# Altium schematic sheet Final Design.SchDoc
size A0; Organization: Altium Limited; Address1: L3, 12a Rodborough Rd; Address2: Frenchs Forest; Address3: NSW; Address4: Australia 2086
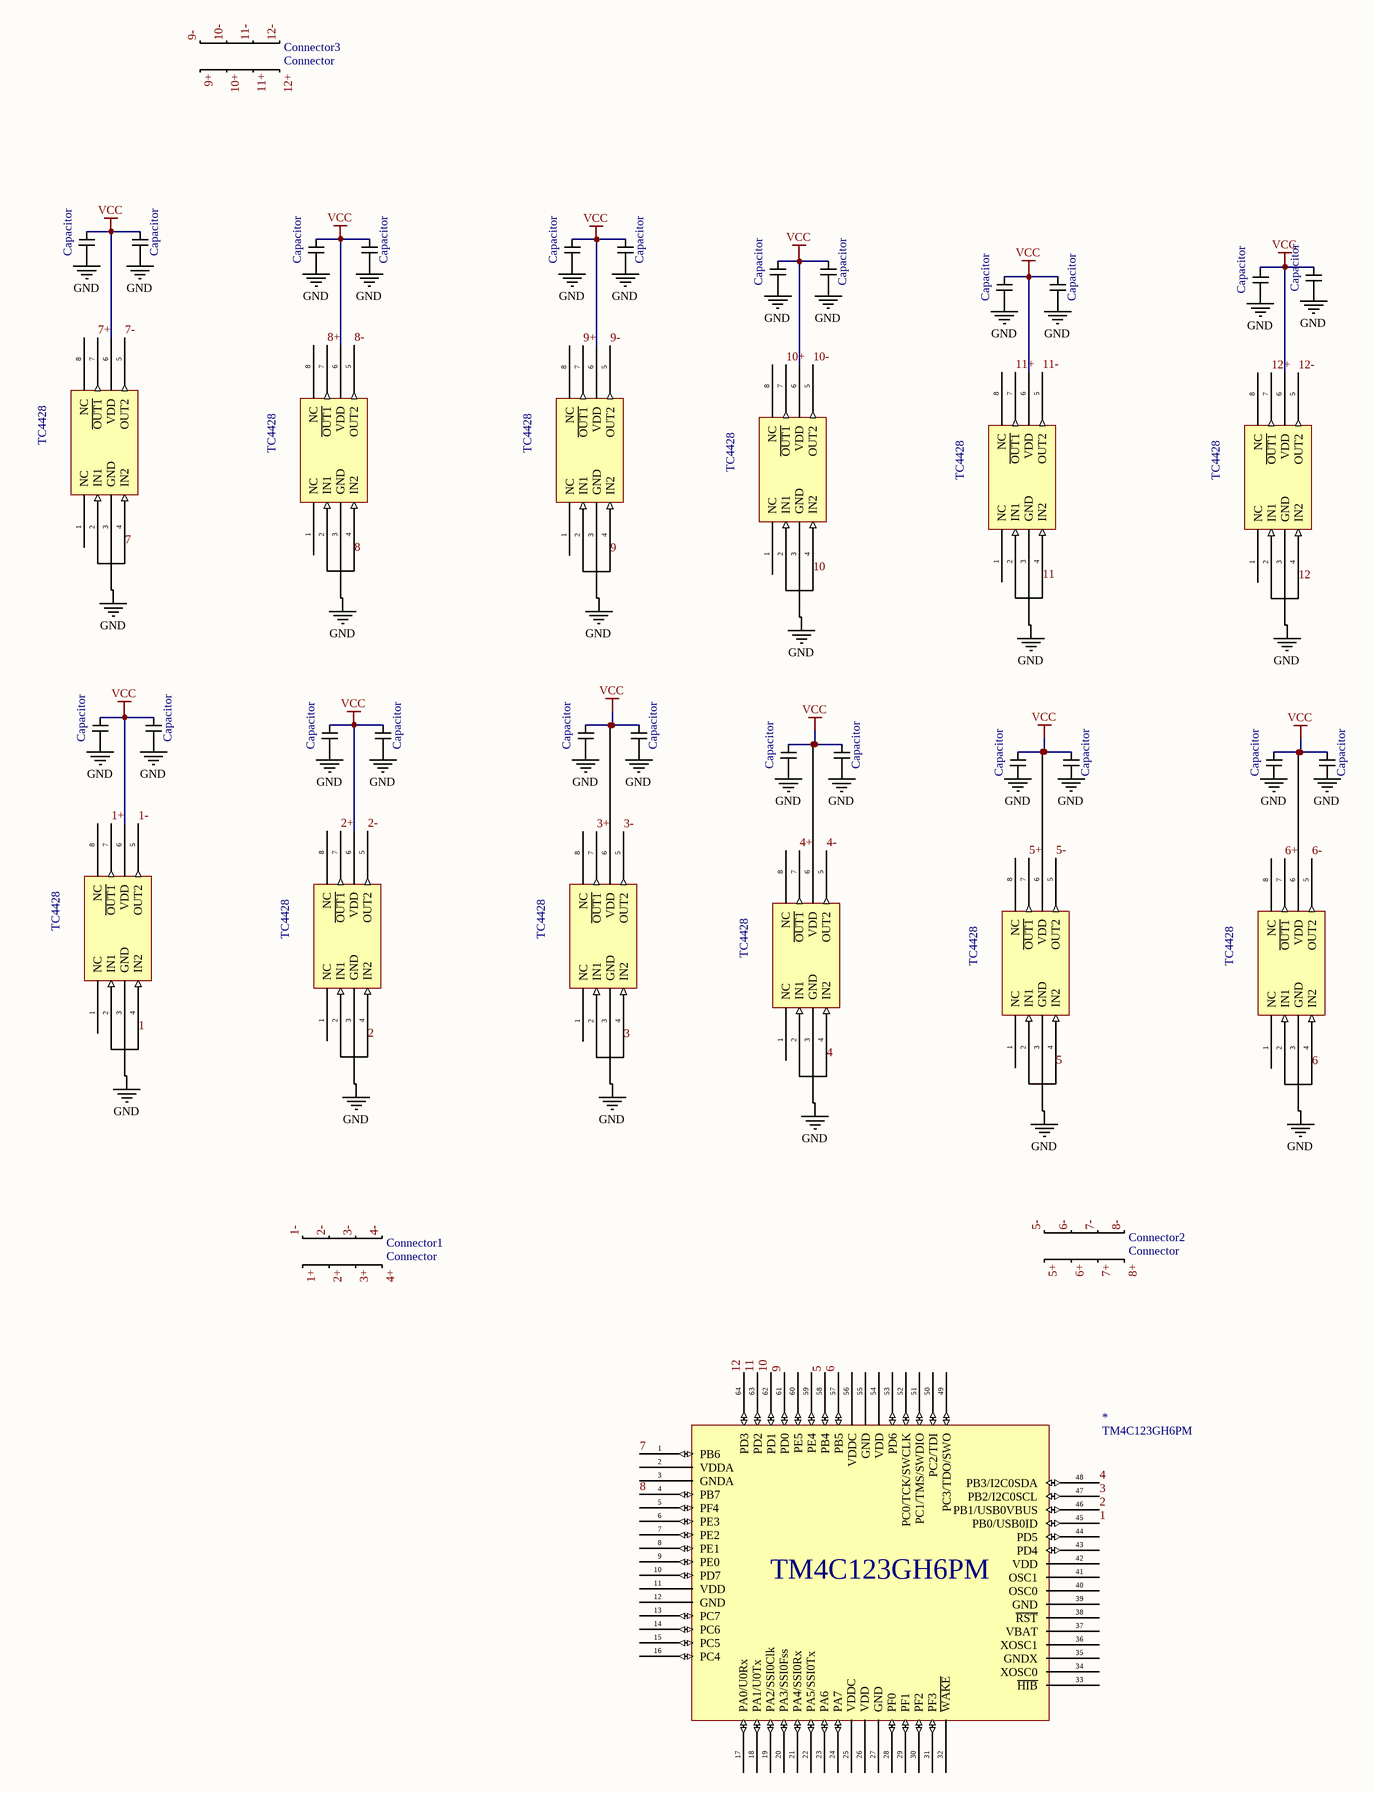
[diagram p0: Final Design.SchDoc]

## Parts
(Parts that share a designator on the sheet are numbered #1, #2 ... from top to bottom, then left to right.)
0.1uF#1  Capacitor  [CAPC3225X06N]
0.1uF#2  Capacitor  [CAPC3225X06N]
0.1uF#3  Capacitor  [CAPC3225X06N]
0.1uF#4  Capacitor  [CAPC3225X06N]
0.1uF#5  Capacitor  [CAPC3225X06N]
0.1uf#6  Capacitor  [CAPC3225X06N]
0.1uF#7  Capacitor  [CAPC3225X06N]
0.1uF#8  Capacitor  [CAPC3225X06N]
0.1uF_3  Capacitor  [CAPC3225X06N]
0.1uF_4  Capacitor  [CAPC3225X06N]
0.1uF_5  Capacitor  [CAPC3225X06N]
0.1uF_6  Capacitor  [CAPC3225X06N]
4.7uF#1  Capacitor  [CAPC3225X06N]
4.7uF#2  Capacitor  [CAPC3225X06N]
4.7uF#3  Capacitor  [CAPC3225X06N]
4.7uF#4  Capacitor  [CAPC3225X06N]
4.7uF#5  Capacitor  [CAPC3225X06N]
4.7uF#6  Capacitor  [CAPC3225X06N]
4.7uF#7  Capacitor  [CAPC3225X06N]
4.7uF_3  Capacitor  [CAPC3225X06N]
4.7uF_4  Capacitor  [CAPC3225X06N]
4.7uF_5  Capacitor  [CAPC3225X06N]
4.7uF_6  Capacitor  [CAPC3225X06N]
4.7uF_11  Capacitor  [CAPC3225X06N]
*  TM4C123GH6PM  [TM4C123]
Connector1  Connector  [Connector]
Connector2  Connector  [Connector]
Connector3  Connector  [Connector]
TC4428_1  TC4428  [TC4428]
TC4428_2  TC4428  [TC4428]
TC4428_3  TC4428  [TC4428]
TC4428_4  TC4428  [TC4428]
TC4428_5  TC4428  [TC4428]
TC4428_6  TC4428  [TC4428]
TC4428_7  TC4428  [TC4428]
TC4428_8  TC4428  [TC4428]
TC4428_9  TC4428  [TC4428]
TC4428_10  TC4428  [TC4428]
TC4428_11  TC4428  [TC4428]
TC4428_12  TC4428  [TC4428]

## Nets
GND: 0.1uF#1.pin-(-) 0.1uF#2.pin-(-) 0.1uF#3.pin-(-) 0.1uF#4.pin-(-) 0.1uf#6.pin-(-) 0.1uF#7.pin-(-) 0.1uF#8.pin-(-) 0.1uF_3.pin-(-) 0.1uF_4.pin-(-) 4.7uF#1.pin-(-) 4.7uF#2.pin-(-) 4.7uF#3.pin-(-) 4.7uF#4.pin-(-) 4.7uF#5.pin-(-) 4.7uF#6.pin-(-) 4.7uF#7.pin-(-) 4.7uF_3.pin-(-) 4.7uF_4.pin-(-) 4.7uF_11.pin-(-) TC4428_1.3(GND) TC4428_2.3(GND) TC4428_3.3(GND) TC4428_4.3(GND) TC4428_5.3(GND) TC4428_6.3(GND) TC4428_7.3(GND) TC4428_8.3(GND) TC4428_9.3(GND) TC4428_10.3(GND) TC4428_11.3(GND) TC4428_12.3(GND)
VCC: 0.1uF#1.pin+(+) 0.1uF#2.pin+(+) 0.1uF#3.pin+(+) 0.1uF#8.pin+(+) 0.1uF_3.pin+(+) 0.1uF_4.pin+(+) 0.1uF_5.pin+(+) 0.1uF_6.pin+(+) 4.7uF#1.pin+(+) 4.7uF#2.pin+(+) 4.7uF#3.pin+(+) 4.7uF#7.pin+(+) 4.7uF_3.pin+(+) 4.7uF_4.pin+(+) 4.7uF_5.pin+(+) 4.7uF_6.pin+(+) TC4428_2.6(VDD) TC4428_3.6(VDD) TC4428_4.6(VDD) TC4428_5.6(VDD) TC4428_6.6(VDD) TC4428_7.6(VDD) TC4428_8.6(VDD) TC4428_9.6(VDD)
1: *.45(PB0/USB0ID) TC4428_1.2(IN1) TC4428_1.4(IN2)
1+: Connector1.1 TC4428_1.7(~{OUT1})
1-: Connector1.5 TC4428_1.5(OUT2)
2: *.46(PB1/USB0VBUS) TC4428_2.2(IN1) TC4428_2.4(IN2)
2+: Connector1.2 TC4428_2.7(~{OUT1})
2-: Connector1.6 TC4428_2.5(OUT2)
3: *.47(PB2/I2C0SCL) TC4428_3.2(IN1) TC4428_3.4(IN2)
3+: Connector1.3 TC4428_3.7(~{OUT1})
3-: Connector1.7 TC4428_3.5(OUT2)
4: *.48(PB3/I2C0SDA) TC4428_4.2(IN1) TC4428_4.4(IN2)
4+: Connector1.4 TC4428_4.7(~{OUT1})
4-: Connector1.8 TC4428_4.5(OUT2)
5: *.58(PB4) TC4428_5.2(IN1) TC4428_5.4(IN2)
5+: Connector2.1 TC4428_5.7(~{OUT1})
5-: Connector2.5 TC4428_5.5(OUT2)
6: *.57(PB5) TC4428_6.2(IN1) TC4428_6.4(IN2)
6+: Connector2.2 TC4428_6.7(~{OUT1})
6-: Connector2.6 TC4428_6.5(OUT2)
7: *.1(PB6) TC4428_7.2(IN1) TC4428_7.4(IN2)
7+: Connector2.3 TC4428_7.7(~{OUT1})
7-: Connector2.7 TC4428_7.5(OUT2)
8: *.4(PB7) TC4428_8.2(IN1) TC4428_8.4(IN2)
8+: Connector2.4 TC4428_8.7(~{OUT1})
8-: Connector2.8 TC4428_8.5(OUT2)
9: *.61(PD0) TC4428_9.2(IN1) TC4428_9.4(IN2)
9+: Connector3.1 TC4428_9.7(~{OUT1})
9-: Connector3.5 TC4428_9.5(OUT2)
10: *.62(PD1) TC4428_10.2(IN1) TC4428_10.4(IN2)
10+: Connector3.2 TC4428_10.7(~{OUT1})
10-: Connector3.6 TC4428_10.5(OUT2)
11: *.63(PD2) TC4428_11.2(IN1) TC4428_11.4(IN2)
11+: Connector3.3 TC4428_11.7(~{OUT1})
11-: Connector3.7 TC4428_11.5(OUT2)
12: *.64(PD3) TC4428_12.2(IN1) TC4428_12.4(IN2)
12+: Connector3.4 TC4428_12.7(~{OUT1})
12-: Connector3.8 TC4428_12.5(OUT2)
Net0.1uF#4_pin+: 0.1uF#4.pin+(+) 4.7uF#4.pin+(+) TC4428_10.6(VDD)
Net0.1uF#5_pin+: 0.1uF#5.pin+(+) 4.7uF#5.pin+(+) TC4428_12.6(VDD)
Net0.1uf#6_pin+: 0.1uf#6.pin+(+) 4.7uF_11.pin+(+) TC4428_11.6(VDD)
Net0.1uF#7_pin+: 0.1uF#7.pin+(+) 4.7uF#6.pin+(+) TC4428_1.6(VDD)

Not connected (* = marked no-connect by the designer): 0.1uF#5 pin-(-); 0.1uF_5 pin-(-); 0.1uF_6 pin-(-); 4.7uF_5 pin-(-); 4.7uF_6 pin-(-); * 2(VDDA) 3(GNDA) 5(PF4) 6(PE3) 7(PE2) 8(PE1) 9(PE0) 10(PD7) 11(VDD) 12(GND) 13(PC7) 14(PC6) 15(PC5) 16(PC4) 17(PA0/U0Rx) 18(PA1/U0Tx) 19(PA2/SSI0Clk) 20(PA3/SSI0Fss) 21(PA4/SSI0Rx) 22(PA5/SSI0Tx) 23(PA6) 24(PA7) 25(VDDC) 26(VDD) 27(GND) 28(PF0) 29(PF1) 30(PF2) 31(PF3) 32(~{WAKE}) 33(~{HIB}) 34(XOSC0) 35(GNDX) 36(XOSC1) 37(VBAT) 38(~{RST}) 39(GND) 40(OSC0) 41(OSC1) 42(VDD) 43(PD4) 44(PD5) 49(PC3/TDO/SWO) 50(PC2/TDI) 51(PC1/TMS/SWDIO) 52(PC0/TCK/SWCLK) 53(PD6) 54(VDD) 55(GND) 56(VDDC) 59(PE4) 60(PE5); TC4428_1 1(NC) 8(NC); TC4428_2 1(NC) 8(NC); TC4428_3 1(NC) 8(NC); TC4428_4 1(NC) 8(NC); TC4428_5 1(NC) 8(NC); TC4428_6 1(NC) 8(NC); TC4428_7 1(NC) 8(NC); TC4428_8 1(NC) 8(NC); TC4428_9 1(NC) 8(NC); TC4428_10 1(NC) 8(NC); TC4428_11 1(NC) 8(NC); TC4428_12 1(NC) 8(NC)

## Notes on the sheet
- Labels drawn without touching a wire or pin: GND, VCC
- Title
- Size:
- Date:
- File:
- A0
- Number:
- Time:
- Revision:
- Sheet
- of

## Library data of the parts
* = TM4C123GH6PM: IC MCU 32BIT 256KB FLASH 64LQFP
TC4428_1-TC4428_12 = TC4428: Dual High-Speed Power MOSFET Drivers